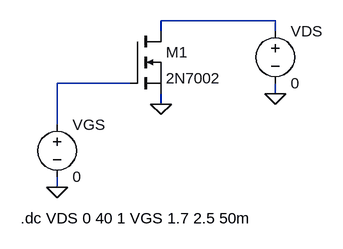
[diagram p0: schematic MOSFET 2N7002 Curvas Características.asc]
MOSFET 2N7002 Curvas Características.asc, the LTspice schematic file:
Version 4
SHEET 1 880 680
WIRE 400 48 224 48
WIRE 224 64 224 48
WIRE 400 64 400 48
WIRE 176 144 64 144
WIRE 400 160 400 144
WIRE 224 176 224 160
WIRE 64 208 64 144
WIRE 64 304 64 288
FLAG 64 304 0
FLAG 224 176 0
FLAG 400 160 0
SYMBOL nmos 176 64 R0
SYMATTR InstName M1
SYMATTR Value 2N7002
SYMBOL voltage 400 48 R0
WINDOW 123 0 0 Left 0
WINDOW 39 0 0 Left 0
SYMATTR InstName VDS
SYMATTR Value 0
SYMBOL voltage 64 192 R0
WINDOW 123 0 0 Left 0
WINDOW 39 0 0 Left 0
SYMATTR InstName VGS
SYMATTR Value 0
TEXT 8 352 Left 2 !.dc VDS 0 40 1 VGS 1.7 2.5 50m

The netlist it stands for:
* MOSFET 2N7002 Curvas Características.asc
M1 N001 N002 0 0 2N7002
VDS N001 0 0
VGS N002 0 0
.model NMOS NMOS
.model PMOS PMOS
.lib standard.mos
.dc VDS 0 40 1 VGS 1.7 2.5 50m
.backanno
.end